# EAGLE board A314-600_v1.0 (EAGLE 7.7.0)
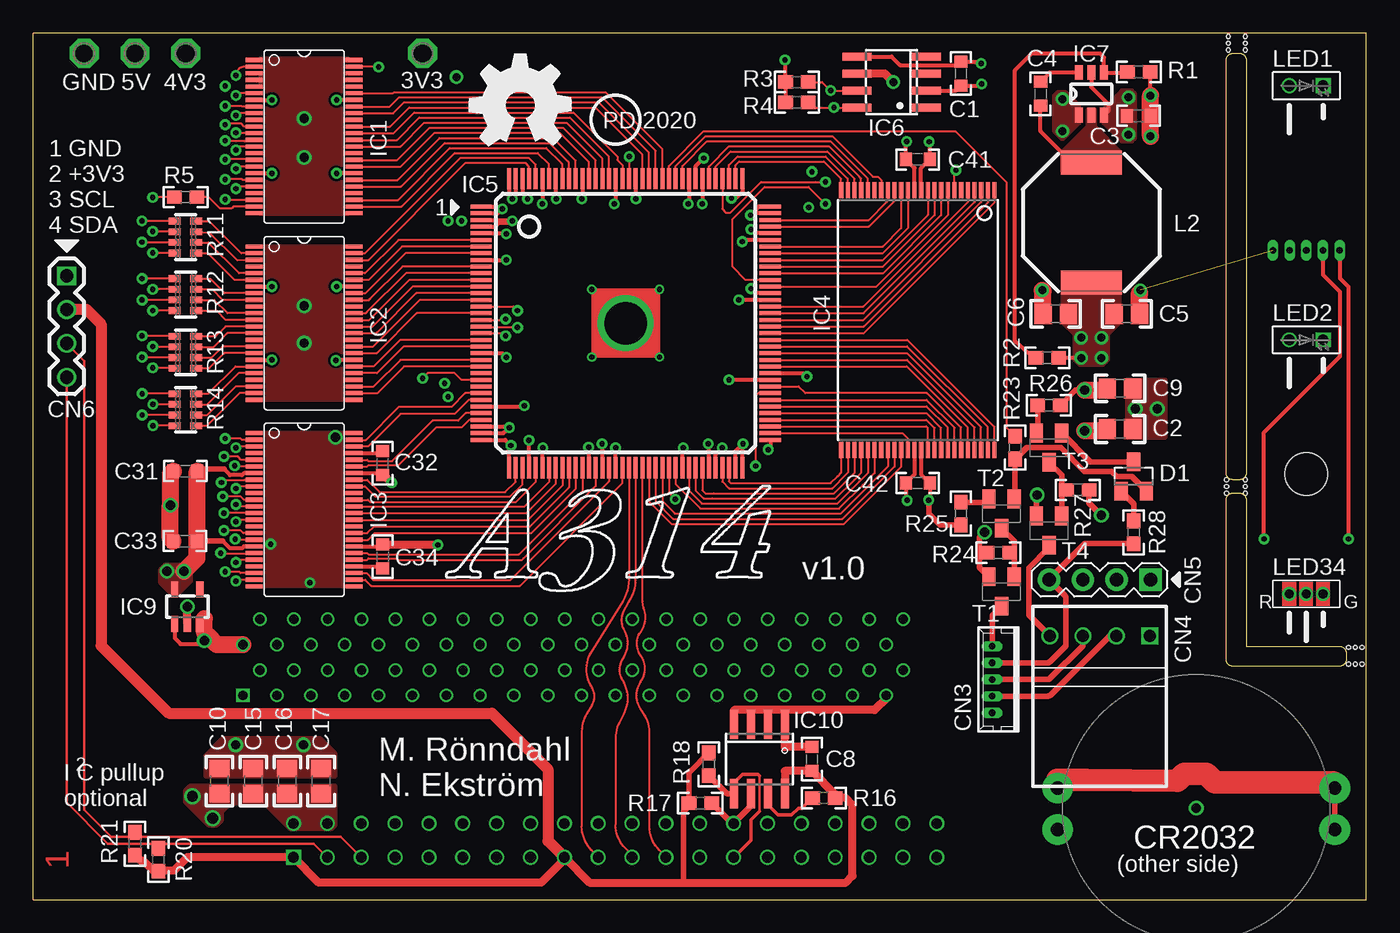
[diagram p5: board, top side]
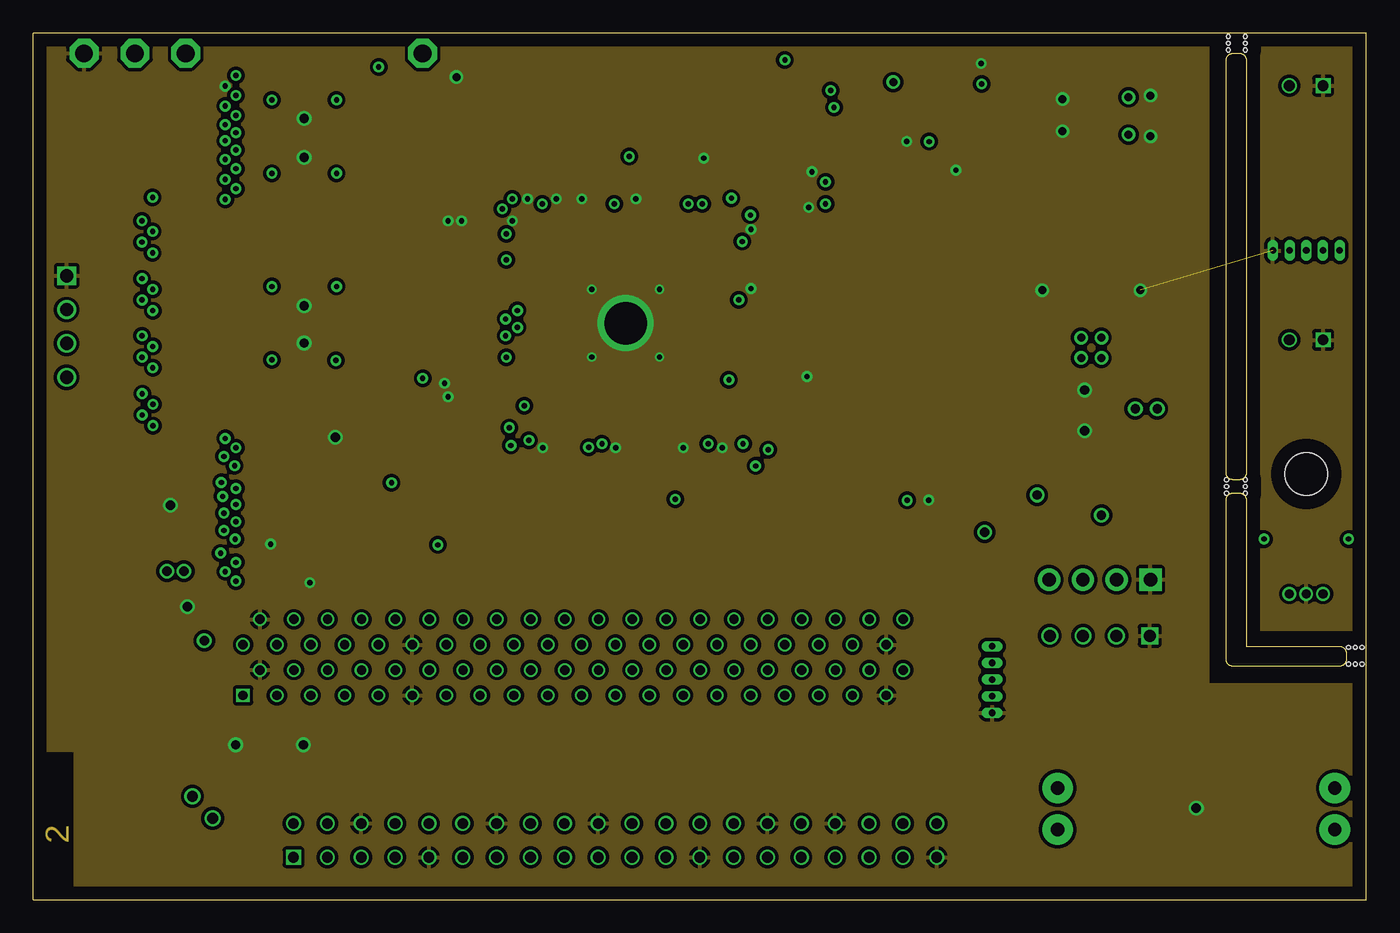
[diagram p6: board, inner layer Ground]
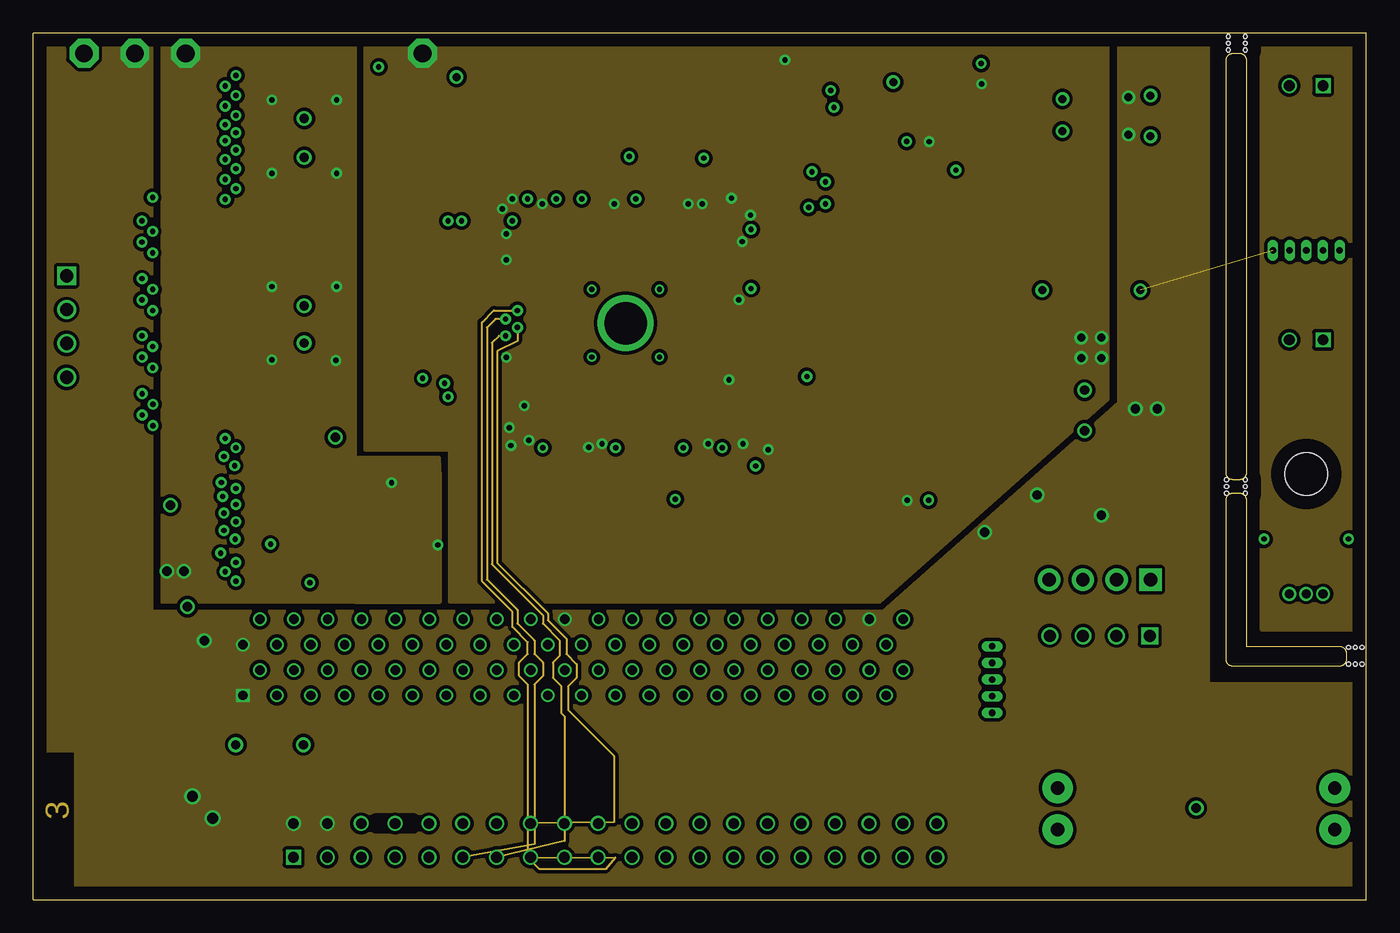
[diagram p7: board, inner layer Power]
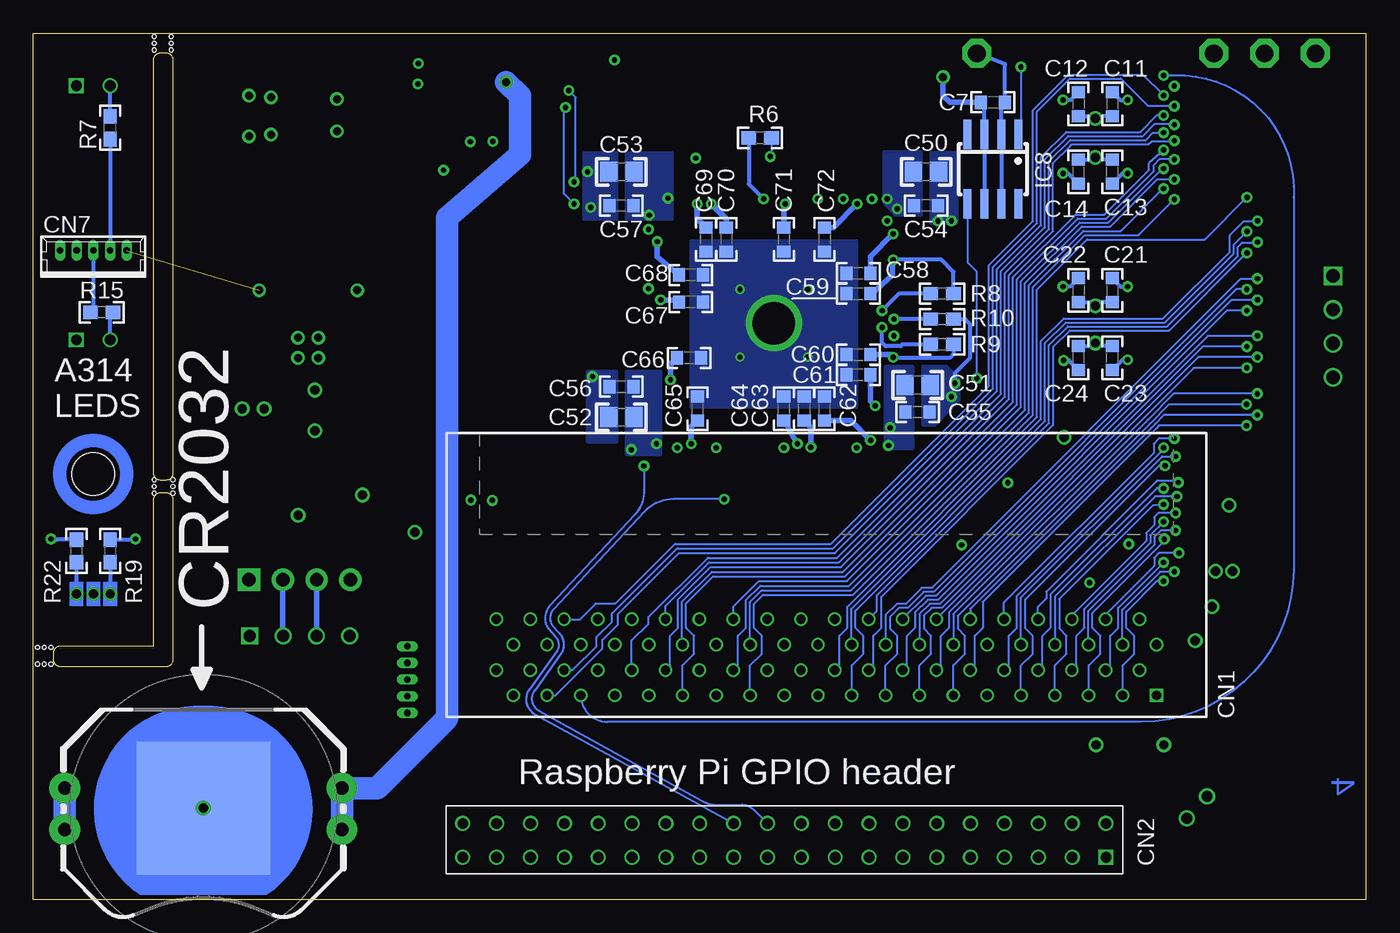
[diagram p8: board, bottom side, seen from below]

Size 100 x 65 mm. Coordinates in mm from the lower left corner, seen from the top.
Outline: 0,0 100,0 100,65 0,65 0,0
Copper layers (1+7*8+16): Top 0.035mm / dielectric 0.185mm / Ground 0.035mm / dielectric 1.15mm / Power 0.035mm / dielectric 0.185mm / Bottom 0.035mm
Design rules "5mil_std *": minimum track width 5mil, minimum drill 0.4mm, track to track 5mil, track to pad 5mil, pad to pad 5mil, via to via 6mil, smd to smd 0mil, copper to edge 40mil, drill to drill 8mil, minimum pad ring 6mil, minimum via ring 8mil, stop-mask expansion 2mil, vias tented up to drill 0.6mm, thermal gap 10mil
Holes 3.2 mm at 95.5,31.94
Holes 0.3 mm at 89.66,63.75 89.66,64.26 89.66,64.77 90.93,63.75 90.93,64.26 90.93,64.77 89.53,30.99 90.93,30.99 89.53,30.48 89.53,31.5 90.93,31.5 90.93,30.48 98.68,18.92 99.19,18.92 99.69,18.92 99.69,17.65 99.19,17.65 98.68,17.65
bKeepout: area 62,38 to 90,65
Milling: 19 lines

## Footprints (pad centres in the part's own frame; a part is rotated, then mirrored left to right if it is on the bottom)
P1-13 = drill 1.321 pad 2.159 octagon: TP 0,0
LINX20XX-THM = drill 1 pad 2.3: +@1 -10.4,1.5; +@2 -10.4,-1.6; +@3 10.4,-1.6; +@4 10.4,1.5 | smd 10 x 10: GND 0,0
C0603 = smd 0.9 x 1: 1 -0.9,0; 2 0.9,0
C0805 = smd 1.3 x 1.5: 1 -0.95,0; 2 0.95,0
CE-2X40_1.27_R = drill 0.7 square: 1 -24.765,-19.685 | drill 0.7: 2 -24.765,-15.875; 3 -23.495,-17.78; 4 -23.495,-13.97; 5 -22.225,-19.685; 6 -22.225,-15.875; 7 -20.955,-17.78; 8 -20.955,-13.97; 9 -19.685,-19.685; 10 -19.685,-15.875; 11 -18.415,-17.78; 12 -18.415,-13.97; 13 -17.145,-19.685; 14 -17.145,-15.875; 15 -15.875,-17.78; 16 -15.875,-13.97; 17 -14.605,-19.685; 18 -14.605,-15.875; 19 -13.335,-17.78; 20 -13.335,-13.97; 21 -12.065,-19.685; 22 -12.065,-15.875; 23 -10.795,-17.78; 24 -10.795,-13.97; 25 -9.525,-19.685; 26 -9.525,-15.875; 27 -8.255,-17.78; 28 -8.255,-13.97; 29 -6.985,-19.685; 30 -6.985,-15.875; 31 -5.715,-17.78; 32 -5.715,-13.97; 33 -4.445,-19.685; 34 -4.445,-15.875; 35 -3.175,-17.78; 36 -3.175,-13.97; 37 -1.905,-19.685; 38 -1.905,-15.875; 39 -0.635,-17.78; 40 -0.635,-13.97; 41 0.635,-19.685; 42 0.635,-15.875; 43 1.905,-17.78; 44 1.905,-13.97; 45 3.175,-19.685; 46 3.175,-15.875; 47 4.445,-17.78; 48 4.445,-13.97; 49 5.715,-19.685; 50 5.715,-15.875; 51 6.985,-17.78; 52 6.985,-13.97; 53 8.255,-19.685; 54 8.255,-15.875; 55 9.525,-17.78; 56 9.525,-13.97; 57 10.795,-19.685; 58 10.795,-15.875; 59 12.065,-17.78; 60 12.065,-13.97; 61 13.335,-19.685; 62 13.335,-15.875; 63 14.605,-17.78; 64 14.605,-13.97; 65 15.875,-19.685; 66 15.875,-15.875; 67 17.145,-17.78; 68 17.145,-13.97; 69 18.415,-19.685; 70 18.415,-15.875; 71 19.685,-17.78; 72 19.685,-13.97; 73 20.955,-19.685; 74 20.955,-15.875; 75 22.225,-17.78; 76 22.225,-13.97; 77 23.495,-19.685; 78 23.495,-15.875; 79 24.765,-17.78; 80 24.765,-13.97
RASPBERRYPIZEROW_NO_HOLES = drill 0.8 square: 1 -24.13,-1.31 | drill 0.8: 2 -24.13,1.23; 3 -21.59,-1.31; 4 -21.59,1.23; 5 -19.05,-1.31; 6 -19.05,1.23; 7 -16.51,-1.31; 8 -16.51,1.23; 9 -13.97,-1.31; 10 -13.97,1.23; 11 -11.43,-1.31; 12 -11.43,1.23; 13 -8.89,-1.31; 14 -8.89,1.23; 15 -6.35,-1.31; 16 -6.35,1.23; 17 -3.81,-1.31; 18 -3.81,1.23; 19 -1.27,-1.31; 20 -1.27,1.23; 21 1.27,-1.31; 22 1.27,1.23; 23 3.81,-1.31; 24 3.81,1.23; 25 6.35,-1.31; 26 6.35,1.23; 27 8.89,-1.31; 28 8.89,1.23; 29 11.43,-1.31; 30 11.43,1.23; 31 13.97,-1.31; 32 13.97,1.23; 33 16.51,-1.31; 34 16.51,1.23; 35 19.05,-1.31; 36 19.05,1.23; 37 21.59,-1.31; 38 21.59,1.23; 39 24.13,-1.31; 40 24.13,1.23
53047-05 = drill 0.5 pad 0.698 long: 1 2.5,0.45; 2 1.25,0.45; 3 0,0.45; 4 -1.25,0.45; 5 -2.5,0.45
FLOPPY_PWR = drill 0.9 square: 1 3.75,4.55 | drill 0.9: 2 1.25,4.55; 3 -1.25,4.55; 4 -3.75,4.55
MA04-1 = drill 1 pad 1.676 square: 1 -3.81,0 | drill 1 pad 1.676: 2 -1.27,0; 3 1.27,0; 4 3.81,0
MA04-1' = drill 1 square: 1 -3.81,0 | drill 1: 2 -1.27,0; 3 1.27,0; 4 3.81,0
SOT23 = smd 1 x 1.4: 1 -0.95,-1.1; 2 0.95,-1.1; 3 0,1.1
PSOP-DGG48 = smd 0.32 x 1.3: 1 -5.75,-3.75; 2 -5.25,-3.75; 3 -4.75,-3.75; 4 -4.25,-3.75; 5 -3.75,-3.75; 6 -3.25,-3.75; 7 -2.75,-3.75; 8 -2.25,-3.75; 9 -1.75,-3.75; 10 -1.25,-3.75; 11 -0.75,-3.75; 12 -0.25,-3.75; 13 0.25,-3.75; 14 0.75,-3.75; 15 1.25,-3.75; 16 1.75,-3.75; 17 2.25,-3.75; 18 2.75,-3.75; 19 3.25,-3.75; 20 3.75,-3.75; 21 4.25,-3.75; 22 4.75,-3.75; 23 5.25,-3.75; 24 5.75,-3.75; 25 5.75,3.75; 26 5.25,3.75; 27 4.75,3.75; 28 4.25,3.75; 29 3.75,3.75; 30 3.25,3.75; 31 2.75,3.75; 32 2.25,3.75; 33 1.75,3.75; 34 1.25,3.75; 35 0.75,3.75; 36 0.25,3.75; 37 -0.25,3.75; 38 -0.75,3.75; 39 -1.25,3.75; 40 -1.75,3.75; 41 -2.25,3.75; 42 -2.75,3.75; 43 -3.25,3.75; 44 -3.75,3.75; 45 -4.25,3.75; 46 -4.75,3.75; 47 -5.25,3.75; 48 -5.75,3.75
TSOP-1_48L_12X20 = smd 1.2 x 0.32: 1 -9.75,5.75; 2 -9.75,5.25; 3 -9.75,4.75; 4 -9.75,4.25; 5 -9.75,3.75; 6 -9.75,3.25; 7 -9.75,2.75; 8 -9.75,2.25; 9 -9.75,1.75; 10 -9.75,1.25; 11 -9.75,0.75; 12 -9.75,0.25; 13 -9.75,-0.25; 14 -9.75,-0.75; 15 -9.75,-1.25; 16 -9.75,-1.75; 17 -9.75,-2.25; 18 -9.75,-2.75; 19 -9.75,-3.25; 20 -9.75,-3.75; 21 -9.75,-4.25; 22 -9.75,-4.75; 23 -9.75,-5.25; 24 -9.75,-5.75; 25 9.75,-5.75; 26 9.75,-5.25; 27 9.75,-4.75; 28 9.75,-4.25; 29 9.75,-3.75; 30 9.75,-3.25; 31 9.75,-2.75; 32 9.75,-2.25; 33 9.75,-1.75; 34 9.75,-1.25; 35 9.75,-0.75; 36 9.75,-0.25; 37 9.75,0.25; 38 9.75,0.75; 39 9.75,1.25; 40 9.75,1.75; 41 9.75,2.25; 42 9.75,2.75; 43 9.75,3.25; 44 9.75,3.75; 45 9.75,4.25; 46 9.75,4.75; 47 9.75,5.25; 48 9.75,5.75
SQFP-S-20X20-144 = smd 0.3 x 1.6: 1 -8.75,-10.85; 2 -8.25,-10.85; 3 -7.75,-10.85; 4 -7.25,-10.85; 5 -6.75,-10.85; 6 -6.25,-10.85; 7 -5.75,-10.85; 8 -5.25,-10.85; 9 -4.75,-10.85; 10 -4.25,-10.85; 11 -3.75,-10.85; 12 -3.25,-10.85; 13 -2.75,-10.85; 14 -2.25,-10.85; 15 -1.75,-10.85; 16 -1.25,-10.85; 17 -0.75,-10.85; 18 -0.25,-10.85; 19 0.25,-10.85; 20 0.75,-10.85; 21 1.25,-10.85; 22 1.75,-10.85; 23 2.25,-10.85; 24 2.75,-10.85; 25 3.25,-10.85; 26 3.75,-10.85; 27 4.25,-10.85; 28 4.75,-10.85; 29 5.25,-10.85; 30 5.75,-10.85; 31 6.25,-10.85; 32 6.75,-10.85; 33 7.25,-10.85; 34 7.75,-10.85; 35 8.25,-10.85; 36 8.75,-10.85; 73 8.75,10.85; 74 8.25,10.85; 75 7.75,10.85; 76 7.25,10.85; 77 6.75,10.85; 78 6.25,10.85; 79 5.75,10.85; 80 5.25,10.85; 81 4.75,10.85; 82 4.25,10.85; 83 3.75,10.85; 84 3.25,10.85; 85 2.75,10.85; 86 2.25,10.85; 87 1.75,10.85; 88 1.25,10.85; 89 0.75,10.85; 90 0.25,10.85; 91 -0.25,10.85; 92 -0.75,10.85; 93 -1.25,10.85; 94 -1.75,10.85; 95 -2.25,10.85; 96 -2.75,10.85; 97 -3.25,10.85; 98 -3.75,10.85; 99 -4.25,10.85; 100 -4.75,10.85; 101 -5.25,10.85; 102 -5.75,10.85; 103 -6.25,10.85; 104 -6.75,10.85; 105 -7.25,10.85; 106 -7.75,10.85; 107 -8.25,10.85; 108 -8.75,10.85 | smd 1.6 x 0.3: 37 10.85,-8.75; 38 10.85,-8.25; 39 10.85,-7.75; 40 10.85,-7.25; 41 10.85,-6.75; 42 10.85,-6.25; 43 10.85,-5.75; 44 10.85,-5.25; 45 10.85,-4.75; 46 10.85,-4.25; 47 10.85,-3.75; 48 10.85,-3.25; 49 10.85,-2.75; 50 10.85,-2.25; 51 10.85,-1.75; 52 10.85,-1.25; 53 10.85,-0.75; 54 10.85,-0.25; 55 10.85,0.25; 56 10.85,0.75; 57 10.85,1.25; 58 10.85,1.75; 59 10.85,2.25; 60 10.85,2.75; 61 10.85,3.25; 62 10.85,3.75; 63 10.85,4.25; 64 10.85,4.75; 65 10.85,5.25; 66 10.85,5.75; 67 10.85,6.25; 68 10.85,6.75; 69 10.85,7.25; 70 10.85,7.75; 71 10.85,8.25; 72 10.85,8.75; 109 -10.85,8.75; 110 -10.85,8.25; 111 -10.85,7.75; 112 -10.85,7.25; 113 -10.85,6.75; 114 -10.85,6.25; 115 -10.85,5.75; 116 -10.85,5.25; 117 -10.85,4.75; 118 -10.85,4.25; 119 -10.85,3.75; 120 -10.85,3.25; 121 -10.85,2.75; 122 -10.85,2.25; 123 -10.85,1.75; 124 -10.85,1.25; 125 -10.85,0.75; 126 -10.85,0.25; 127 -10.85,-0.25; 128 -10.85,-0.75; 129 -10.85,-1.25; 130 -10.85,-1.75; 131 -10.85,-2.25; 132 -10.85,-2.75; 133 -10.85,-3.25; 134 -10.85,-3.75; 135 -10.85,-4.25; 136 -10.85,-4.75; 137 -10.85,-5.25; 138 -10.85,-5.75; 139 -10.85,-6.25; 140 -10.85,-6.75; 141 -10.85,-7.25; 142 -10.85,-7.75; 143 -10.85,-8.25; 144 -10.85,-8.75 | drill 0.4: GB@4 -2.54,-2.54; GP@1 -2.54,2.54; GP@2 2.54,2.54; GP@3 2.54,-2.54 | drill 3.2: GP@5 0,0
SOIC8 = smd 0.6 x 2.2: 1 -1.905,-2.6; 2 -0.635,-2.6; 3 0.635,-2.6; 4 1.905,-2.6; 5 1.905,2.6; 6 0.635,2.6; 7 -0.635,2.6; 8 -1.905,2.6
THIN_SO23 = smd 0.6 x 1.1: 1 -0.95,-1.6; 2 0,-1.6; 3 0.95,-1.6; 4 0.95,1.6; 5 0,1.6; 6 -0.95,1.6
SO08 = smd 0.6 x 2.2: 1 -1.905,-2.6; 2 -0.635,-2.6; 3 0.635,-2.6; 4 1.905,-2.6; 5 1.905,2.6; 6 0.635,2.6; 7 -0.635,2.6; 8 -1.905,2.6
SOT23-DBV = smd 0.55 x 1.2: 1 -0.95,-1.3; 2 0,-1.3; 3 0.95,-1.3; 4 0.95,1.3; 5 -0.95,1.3
SO-08 = smd 0.6 x 2.2: 1 -1.905,-2.6; 2 -0.635,-2.6; 3 0.635,-2.6; 4 1.905,-2.6; 5 1.905,2.6; 6 0.635,2.6; 7 -0.635,2.6; 8 -1.905,2.6
WE-TPC_1028/1038 = smd 4.6 x 1.8: 1 0,4.5; 2 0,-4.5
LED2X5 = drill 0.8: A -1.27,0 | drill 0.8 square: K 1.27,0
DUOLED2X5 = drill 0.7 pad 1.016: AG -1.27,0; AR 1.27,0; K 0,0
R0603 = smd 1.1 x 1: 1 -0.85,0; 2 0.85,0
CTS742C083 = smd 0.5 x 0.9: 1 -1.2,-0.8; 2 -0.4,-0.8; 3 0.4,-0.8; 4 1.2,-0.8; 5 1.2,0.8; 6 0.4,0.8; 7 -0.4,0.8; 8 -1.2,0.8
SOT23-BEC = smd 1 x 1.4: B -0.95,-1.1; C 0,1.1; E 0.95,-1.1

## Placement (x,y rotation side)
3V3  TPPAD1-13  [P1-13]  29.21,63.5 0 top
4V3  TPPAD1-13  [P1-13]  11.43,63.5 0 top
5V  TPPAD1-13  [P1-13]  7.62,63.5 0 top
BAT1  CR2025/CR2032TH  [LINX20XX-THM]  87.25,6.86 0 bottom
C1  100n  [C0603]  69.6,61.98 90 top
C2  22u  [C0805]  81.53,35.31 180 top
C3  100n  [C0603]  82.93,58.8 180 top
C4  100n  [C0603]  75.56,60.45 270 top
C5  22u  [C0805]  82.04,43.94 0 top
C6  22u  [C0805]  76.71,43.94 180 top
C7  100n  [C0603]  28,59.82 180 bottom
C8  100n  [C0603]  58.42,10.54 90 top
C9  22u  [C0805]  81.53,38.35 180 top
C10  22u  [C0805]  13.97,8.89 90 top
C11  100n  [C0603]  19.05,59.69 270 bottom
C12  100n  [C0603]  21.59,59.69 270 bottom
C13  100n  [C0603]  19.05,54.61 90 bottom
C14  100n  [C0603]  21.59,54.61 90 bottom
C15  22u  [C0805]  16.51,8.89 90 top
C16  22u  [C0805]  19.05,8.89 90 top
C17  22u  [C0805]  21.59,8.89 90 top
C21  100n  [C0603]  19.05,45.72 270 bottom
C22  100n  [C0603]  21.59,45.72 270 bottom
C23  100n  [C0603]  19.05,40.64 90 bottom
C24  100n  [C0603]  21.59,40.64 90 bottom
C31  100n  [C0603]  11.4,32.15 180 top
C32  100n  [C0603]  26.21,32.75 90 top
C33  100n  [C0603]  11.38,26.9 180 top
C34  100n  [C0603]  26.21,25.73 270 top
C41  100n  [C0603]  66.36,55.53 180 top
C42  100n  [C0603]  66.36,31.25 0 top
C50  33u  [C0805]  33.02,54.61 0 bottom
C51  33u  [C0805]  33.66,38.61 0 bottom
C52  33u  [C0805]  55.88,36.2 180 bottom
C53  33u  [C0805]  55.88,54.61 180 bottom
C54  100n  [C0603]  33.02,52.07 0 bottom
C55  100n  [C0603]  33.66,36.58 0 bottom
C56  100n  [C0603]  55.88,38.48 180 bottom
C57  100n  [C0603]  55.88,52.07 180 bottom
C58  100n  [C0603]  38.1,46.99 180 bottom
C59  100n  [C0603]  38.1,45.47 180 bottom
C60  100n  [C0603]  38.1,40.89 180 bottom
C61  100n  [C0603]  38.1,39.37 180 bottom
C62  100n  [C0603]  40.64,36.83 90 bottom
C63  100n  [C0603]  42.16,36.83 90 bottom
C64  100n  [C0603]  43.69,36.83 90 bottom
C65  100n  [C0603]  50.16,36.83 90 bottom
C66  100n  [C0603]  50.8,40.64 0 bottom
C67  100n  [C0603]  50.67,44.83 0 bottom
C68  100n  [C0603]  50.67,46.86 0 bottom
C69  100n  [C0603]  49.53,49.53 270 bottom
C70  100n  [C0603]  48.01,49.53 270 bottom
C71  100n  [C0603]  43.69,49.53 270 bottom
C72  100n  [C0603]  40.64,49.53 270 bottom
CN1  A600TDRA_R  [CE-2X40_1.27_R]  40.5,35 0 top
CN2  RASPI_WNH  [RASPBERRYPIZEROW_NO_HOLES]  43.65,4.48 0 top
CN3  53047-05  [53047-05]  72.39,16.51 90 top
CN4  TE171826-4  [FLOPPY_PWR]  80.01,15.24 0 top
CN5  [MA04-1]  80.01,24 180 top
CN6  PIN_HDR  [MA04-1']  2.5,43 270 top
CN7  53047-05  [53047-05]  95.5,48.26 0 bottom
D1  RB715UMTL  [SOT23]  82.55,31.75 0 top
GND  TPPAD1-13  [P1-13]  3.81,63.5 0 top
IC1  SN74CBT16244CDGG  [PSOP-DGG48]  20.32,57.25 270 top
IC2  SN74CBT16244CDGG  [PSOP-DGG48]  20.32,43.25 270 top
IC3  SN74CBT16244CDGG  [PSOP-DGG48]  20.32,29.25 270 top
IC4  IS61WV102416FBLL-TLI  [TSOP-1_48L_12X20]  66.36,43.5 270 top
IC5  10M08SCE144  [SQFP-S-20X20-144]  44.44,43.25 270 top
IC6  DS3231M  [SOIC8]  64.39,61.34 90 top
IC7  TPS565208  [THIN_SO23]  79.38,60.45 0 top
IC8  NB3N502  [SO08]  28,54.8 180 bottom
IC9  TPS77033  [SOT23-DBV]  11.56,21.97 0 top
IC10  24AA32ASN  [SO-08]  54.48,10.54 180 top
L2  2.2uH  [WE-TPC_1028/1038]  79.38,50.8 0 top
LED1  SSL-LX2573GD  [LED2X5]  95.5,61.07 0 top
LED2  SSL-LX2573YD  [LED2X5]  95.5,42 0 top
LED34  SSL-LX2577IGW  [DUOLED2X5]  95.5,22.93 0 top
R1  10k2  [R0603]  82.93,62.1 180 top
R2  34k  [R0603]  76.07,40.64 0 top
R3  3k9  [R0603]  57.28,61.34 180 top
R4  3k9  [R0603]  57.28,59.82 180 top
R5  47  [R0603]  11.43,52.7 0 top
R6  10k  [R0603]  45.47,57.15 180 bottom
R7  150  [R0603]  94.23,57.91 90 bottom
R8  10k  [R0603]  31.81,45.47 0 bottom
R9  10k  [R0603]  31.81,41.66 0 bottom
R10  1k  [R0603]  31.81,43.56 180 bottom
R11  47  [CTS742C083]  11.42,49.71 270 top
R12  47  [CTS742C083]  11.42,45.39 270 top
R13  47  [CTS742C083]  11.42,41.07 270 top
R14  47  [CTS742C083]  11.42,36.75 270 top
R15  150  [R0603]  94.87,44.07 0 bottom
R16  1k  [R0603]  59.31,7.62 0 top
R17  3k9  [R0603]  50.04,7.24 0 top
R18  3k9  [R0603]  50.67,10.16 90 top
R19  150  [R0603]  94.23,26.16 270 bottom
R20  3k9  [R0603]  9.4,3 90 top
R21  3k9  [R0603]  7.62,4.19 90 top
R22  150  [R0603]  96.77,26.16 270 bottom
R23  4k7  [R0603]  73.66,33.91 270 top
R24  10k  [R0603]  72.39,26.04 180 top
R25  470  [R0603]  69.6,28.96 90 top
R26  470  [R0603]  76.2,37.08 180 top
R27  10k  [R0603]  78.36,30.73 0 top
R28  4k7  [R0603]  82.55,27.56 270 top
T1  2N4403  [SOT23-BEC]  72.64,23.11 180 top
T2  2N4401  [SOT23-BEC]  72.64,28.96 180 top
T3  2N4401  [SOT23-BEC]  76.2,33.91 180 top
T4  2N4403  [SOT23-BEC]  76.2,27.69 180 top
U$1  [OSHW_8_NOTEXT]  36.51,59.59 0 top
U$2  [A314_LOGO]  30.86,23.11 0 top

## Tracks (layer width: path | path; a pad name or v marks a point on that pad's centre or on a via)
3VA0
  Top 0.15: IC5.25 27.81,40 25.91,38.1 25.81,38 IC2.26
3VA1
  Top 0.15: IC5.24 27.55,40.5 25.65,38.61 25.55,38.5 IC2.27
3VA2
  Top 0.15: IC5.22 27.78,41.5 25.78,39.5 IC2.29
3VA3
  Top 0.15: IC5.21 27.52,42 25.53,40.01 IC2.30
3VA4
  Top 0.15: IC5.17 28.76,44 25.78,41.02 25.76,41 IC2.32
3VA5
  Top 0.15: IC5.15 29,45 25.53,41.53 25.5,41.5 IC2.33
3VA6
  Top 0.15: IC5.14 28.74,45.5 25.78,42.55 25.74,42.5 IC2.35
3VA7
  Top 0.15: IC5.13 28.47,46 25.53,43.05 25.47,43 IC2.36
3VA8
  Top 0.15: IC5.12 28.21,46.5 25.27,43.56 25.21,43.5 IC2.37
3VA9
  Top 0.15: IC5.11 27.95,47 25.02,44.07 24.95,44 IC2.38
3VCASL0
  Top 0.15: IC5.8 27.93,48.5 25.02,45.59 24.93,45.5 IC2.41
3VCASL1
  Top 0.15: IC5.7 27.66,49 25.15,46.48 24.09,46.48 IC2.43
3VCASU0
  Top 0.15: IC5.10 27.69,47.5 25.27,45.09 25.19,45 IC2.40
3VCASU1
  Top 0.15: IC5.6 27.4,49.5 24.89,46.99 IC2.44
3VCCK  (via drill 0.4)
  Top 0.15: v25.91,62.48 24.09,62.48 IC1.47
  Bottom 0.15: v25.91,62.48 25.91,57.59 IC8.1
3VCPA2
  Top 0.15: IC1.33 27.31,55.5 29.72,57.91 39.75,57.91 42.04,55.63 42.19,55.47 IC5.131
3VCPA3
  Top 0.15: IC1.35 27.54,56.5 29.34,58.29 40.01,58.29 42.55,55.75 42.69,55.61 IC5.130
3VCPA4
  Top 0.15: IC1.36 27.28,57 28.96,58.67 40.26,58.67 43.05,55.88 43.19,55.74 IC5.129
3VCPA5
  Top 0.15: IC1.37 27.02,57.5 28.57,59.05 40.51,59.05 43.81,55.75 43.81,55.5 44.2,55.12 IC5.127
3VCPD0
  Top 0.15: IC1.27 27.35,52.5 31.24,56.39 38.48,56.39 39.62,55.24 39.69,55.18 IC5.136
3VCPD1
  Top 0.15: IC1.29 27.59,53.5 30.86,56.77 38.73,56.77 40.13,55.37 40.19,55.31 IC5.135
3VCPD2
  Top 0.15: IC1.30 27.33,54 30.48,57.15 38.99,57.15 40.64,55.5 40.69,55.45 IC5.134
3VCPD3
  Top 0.15: IC1.32 27.57,55 29.97,57.4 30.1,57.53 39.5,57.53 41.66,55.37 41.69,55.34 IC5.132
3VD0
  Top 0.15: IC5.54 44.2,31.24 36.5,23.55 25.35,23.55 24.9,24 IC3.26
3VD1
  Top 0.15: IC5.52 43.19,31.38 35.81,24 25.5,24 25,24.5 IC3.27
3VD2
  Top 0.15: IC5.50 42.19,31.01 36.78,25.6 36.68,25.5 27.35,25.5 27.25,25.6 25.15,25.6 25.05,25.5 IC3.29
3VD3
  Top 0.15: IC5.48 41.19,30.65 36.44,25.9 25.15,25.9 25.05,26 IC3.30
3VD4
  Top 0.15: IC3.32 25.1,27 25.6,27.5 37.37,27.5 40.69,30.82 IC5.47
3VD5
  Top 0.15: IC5.46 40.19,30.92 37.27,28 25.55,28 25.05,27.5 IC3.33
3VD6
  Top 0.15: IC3.35 37.14,28.5 39.69,31.05 IC5.45
3VD7
  Top 0.15: IC3.36 37,29 39.19,31.19 IC5.44
3VD8
  Top 0.15: IC3.37 36.87,29.5 38.69,31.32 IC5.43
3VD9
  Top 0.15: IC3.38 25.12,30 25.27,29.84 36.22,29.84 37.69,31.34 IC5.41
3VD10
  Top 0.15: IC3.40 24.88,31 25.65,30.23 35.77,30.23 36.69,31.15 IC5.39
3VD11
  Top 0.15: IC3.41 25.05,31.5 25.98,30.57 35.41,30.57 36.19,31.35 IC5.38
3VD12
  Top 0.15: IC5.33 32.7,36 32.13,35.43 30.23,35.43 27.39,32.6 25.15,32.6 25.05,32.5 IC3.43 24.08,32.51
3VD13
  Top 0.15: IC5.32 32.44,36.5 31.88,35.94 29.97,35.94 26.93,32.9 25.15,32.9 25.05,33 IC3.44
3VD14
  Top 0.15: IC5.30 32.67,37.5 31.62,36.45 27.55,36.45 25.1,34 24.4,34 IC3.46
3VD15
  Top 0.15: IC5.29 32.41,38 31.37,36.96 27.41,36.96 24.95,34.5 IC3.47
3VINT2
  Top 0.15: IC1.38 26.76,58 28.19,59.44 42.16,59.44 45.69,55.91 IC5.124
3VIORD
  Top 0.15: IC1.41 26.73,59.5 27.43,60.2 42.67,60.2 46.69,56.18 IC5.122
3VIOWR
  Top 0.15: IC1.43 26.97,60.5 27.05,60.58 42.93,60.58 47.19,56.31 IC5.121
3VRAS0
  Top 0.15: IC2.46 25.14,48 32.13,54.99 32.38,55.24 36.96,55.24 37.19,55.01 IC5.141
3VRAS1
  Top 0.15: IC2.47 24.88,48.5 32,55.63 37.21,55.63 37.69,55.15 IC5.140
3VRTCCS
  Top 0.15: IC1.40 27,59 27.81,59.82 42.42,59.82 46.19,56.05 IC5.123
3VWE
  Top 0.15: IC1.26 27.62,52 31.62,56.01 37.85,56.01 38.69,55.16 IC5.138
5V_PI
  cutout Power: 25.02,5.71 arc-90 25.78,6.48 28.45,6.48 arc-90 29.21,5.71 arc-90 28.45,4.95 25.78,4.95 arc-90
14MHZ  (via drill 0.4)
  Top 0.15: IC5.27 32.12,39 31.75,39.37 31.62,39.5 29.59,39.5 v29.21,39.12
  Bottom 0.15: v29.21,39.12 29.21,47.12 29.84,47.75 29.91,47.82 IC8.5
+  (via drill 0.6)
  Top 0.406: BAT1.+@2 97.65,7.76
  Top 0.61: v64.52,61.34 63.88,61.98 IC6.6
  Top 1.676: BAT1.+@4 76.85,9 79,9 85.83,8.9 86.36,9.43 88.01,9.43 88.65,8.79 97.55,8.79 BAT1.+@1
  Bottom 1.676: BAT1.+@1 BAT1.+@2 | BAT1.+@3 BAT1.+@4 74.19,8.36 68.96,13.59 68.96,51.18 63.5,55.88 63.5,60.33 v64.52,61.34
+3V3  (via drill 0.4, 0.6)
  Top 0.305: IC4.12 66.61,54.88 C41.1 67.26,56.82 v67.21,56.88 | IC4.36 66.11,31.9 C42.1 65.46,30.05 v65.56,29.95 | IC5.9 v35.49,48 | IC5.5 35.44,50 v35.49,49.95 | IC5.23 35.19,41 v35.49,40.7 | IC5.31 36.79,37 v36.84,37.05 | IC5.34 35.63,35.5 v35.72,35.41 35.24,35 IC5.35 | IC5.36 35.41,34.5 v35.84,34.07 35.69,33.8 IC5.37 | IC5.143 36.19,52.83 v35.94,52.58 35.69,52.83 IC5.144 | IC5.1 34.99,52 v35.18,51.82 34.86,51.5 IC5.2 | IC5.40 v37.19,34.45 | IC5.49 41.69,33.92 v41.66,33.95 | IC5.51 42.69,34.17 v42.66,34.2 | IC5.67 50.69,34.15 v50.64,34.2 | IC5.71 52.69,33.64 v53.25,34.2 53.19,34.14 IC5.72 | IC5.73 55.29,33.91 v55.14,33.76 | IC5.82 v52.19,39 | IC5.128 43.69,52.3 v43.59,52.2 | IC5.139 v38.19,52.2 | v56.39,62.99 56.39,61.38 R3.2 R4.2 | v71.14,61.19 71.03,61.08 C1.1 69.23,60.71 IC6.2 | IC5.115 v50.19,52.2 | IC5.117 49.19,52.25 v49.14,52.2 | IC5.103 53.32,49.5 v53.19,49.37 | IC5.94 v52.94,45 | v78.61,40.64 R2.2 | IC5.109 53.19,53.1 52.69,52.6 52.41,52.6 v52.38,52.63 | IC5.107 53.94,51.5 v53.8,51.36 54.44,52 IC5.108
  Bottom 0.305: C59.1 37.08,45.47 | 35.56,47.93 v35.49,48 v35.48,48.01 31.88,48.01 30.96,47.09 R8.2 | C70.1 48.01,50.55 | R9.2 30.96,40.92 31.24,40.64 35.43,40.64 v35.49,40.7 | IC8.7 IC8.2 27.37,59.55 C7.1 27.1,62.66 3V3.TP
  Bottom 0.406: C60.1 35.56,40.89 v35.49,40.7 | C61.1 37.2,37.41 v36.84,37.05 | 37.08,45.47 35.56,46.86 35.56,47.93 | C58.1 37.2,48.24 v35.49,49.95 | C72.1 39.96,50.43 v38.19,52.2 | v50.19,52.2 50.19,51.09 C69.1 | 48.01,50.55 48.01,51.05 49.15,52.2 v49.14,52.2 | C68.1 53.19,48.23 v53.19,49.37 | C66.1 52.19,40.15 v52.19,39 | C64.1 43.35,35.34 v42.66,34.2 | C65.1 50.64,35.45 v50.64,34.2 | v43.59,52.2 43.69,52.1 C71.1 | C67.1 51.74,45 v52.94,45 | C62.1 38.66,35.93 v37.19,34.45 | C63.1 41.66,35.43 v41.66,33.95
  other vias: 80.14,42.16 78.61,42.16 80.14,40.64
  pour Bottom (no thermals): 55.5,33.41 52.96,33.41 52.96,39.6 55.5,39.6
  pour Bottom (no thermals): 36.07,33.8 34.03,33.83 34.04,40.01 36.07,40.01
  pour Bottom (no thermals): 36.2,56.1 36.2,52.32 35.31,51.37 33.4,51.37 33.4,56.1
  pour Bottom (no thermals): 55.5,51.05 52.07,51.05 52.07,56.01 55.5,56.01
  pour Power (isolate 0.254, no thermals): 24.89,64.77 24.89,33.78 31.24,33.78 31.24,22.35 63.5,22.35 80.61,37.56 80.61,64.77
  pour Top (no thermals): 77.22,46.99 77.22,43.31 78.11,42.42 78.11,40.51 78.49,40.13 80.26,40.13 80.64,40.51 80.64,42.42 81.53,43.31 81.53,46.99
+4.3V  (via drill 0.4, 0.7)
  Top 0.305: IC1.7 v17.9,60 | IC1.42 v22.75,60 | IC1.31 v22.75,54.5 | IC1.18 v17.9,54.5 | IC2.18 v17.9,40.5 | IC2.7 v17.9,46 | IC2.42 v22.75,46 | IC2.31 22.75,40.5 v22.7,40.45 | IC3.18 15.8,26.5 15.65,26.35 14.75,26.35 14.2,26.9 | IC3.7 15.8,32 15.65,31.85 14.75,31.85 14.3,32.3 | 12.5,32.3 12.3,32.1 12.3,31.75 | IC3.42 26.06,32 C32.1 | IC3.31 26.08,26.5 C34.1
  Top 0.406: 14.2,26.9 C33.1 | 14.3,32.3 12.5,32.3
  Top 0.61: v26.88,31.27 26.27,31.91 C32.1 | v30.35,26.61 26.23,26.61 C34.1
  Top 1.27: v11.3,24.64 12.28,25.61 C33.1 12.3,26.92 12.3,31.75 C31.1
  Bottom 0.305: C23.1 18.29,40.5 v17.9,40.5 | C24.1 22.3,40.45 v22.7,40.45 | C21.1 18.43,46 v17.9,46 | C22.1 22.21,46 v22.75,46 | C13.1 18.26,54.5 v17.9,54.5 | C14.1 22.38,54.5 v22.75,54.5 | C11.1 18.46,60 v17.9,60 | C12.1 22.18,60 v22.75,60
  other vias: 10.03,24.64
  pour Power (isolate 0.254, no thermals): 9.65,64.77 9.65,22.35 24.13,22.35 24.13,22.35 30.5,22.35 30.5,31.8 30.45,33.12 24.13,33.12 24.13,64.77
  pour Top (no thermals): 10.41,22.86 9.53,23.75 9.53,24.77 9.91,25.15 11.43,25.15 11.81,24.77 11.81,23.88 10.79,22.86
+5V  (via drill 0.6, 0.7, 0.8)
  Top 0.305: IC7.5 79.38,60.96 80.64,59.69 80.64,59.17 IC7.3 | 12.83,21.08 12.83,20.99 IC9.3 | IC9.1 10.61,19.62 11.05,19.18 12.45,19.18 13.08,19.81
  Top 0.406: T1.E 70.99,24.91 70.99,26.04 | 70.99,26.04 70.99,27.18 v71.37,27.56 | R27.2 79.21,29.76 v80.14,28.83 | T4.E 75.25,30.29 v75.31,30.35 | R24.2 70.99,26.04
  Top 1.27: CN1.2 13.77,19.12 13.08,19.81 12.83,20.07 12.83,21.08
  other vias: 84.33,36.83 82.68,36.83 82.17,60.2 82.17,57.4 12.83,19.43 11.94,7.75 13.46,6.1
  pour Power (isolate 0.254, rank 2, no thermals): 3.17,0 99.11,0 99.11,16.13 88.14,16.13 88.14,64.77 81.44,64.77 81.44,37.24 63.75,21.59 8.89,21.59 8.89,64.77 0.17,64.77 0,11.19 3.17,11.19
  pour Top (no thermals): 82.04,34.67 84.96,34.67 84.96,38.99 82.04,38.99
  pour Top (no thermals): 80.26,58.29 81.66,56.9 82.42,56.9 82.68,57.15 82.68,60.45 82.42,60.71 81.66,60.71 80.26,59.31
  pour Top (no thermals): 12.06,8.5 22.61,8.5 22.61,5.59 22.35,5.33 19.3,5.33 17.4,7.24 14.73,7.24 14.1,6.6 14.1,5.97 13.72,5.59 13.21,5.59 11.43,7.37 11.43,8.13 11.81,8.51
A2  (via drill 0.4)
  Top 0.15: IC1.16 16.53,55.54 v14.4,55.54
  Bottom 0.15: CN1.57 51.3,17.57 50.42,18.45 50.42,19.8 51.02,20.4 51.02,22.22 48.99,24.25 39.09,24.25 26.2,37.14 26.2,46.5 26.2,46.55 21.65,51.1 19.5,51.1 15.95,54.65 15.95,55.1 15.51,55.54 v14.4,55.54
A3  (via drill 0.4)
  Top 0.15: IC1.14 15.46,56.5 v15.2,56.24
  Bottom 0.15: CN1.58 51.3,19.18 51.32,19.2 51.32,22.37 49.09,24.6 39.29,24.6 39.24,24.6 26.5,37.34 26.5,46.65 26.5,46.7 21.8,51.4 19.65,51.4 16.3,54.75 16.3,55.25 16.29,55.25 v15.2,56.24
A4  (via drill 0.4)
  Top 0.15: IC1.13 15.84,56.9 14.61,56.9 14.44,56.9 v14.4,56.94
  Bottom 0.15: CN1.59 52.56,17.2 52.22,17.55 52.22,19.8 51.62,20.4 51.62,22.52 49.61,24.53 49.19,24.95 39.39,24.95 26.8,37.54 26.8,46.85 23.5,50.16 23.5,55.24 22.25,56.49 22.07,56.66 16.36,56.66 16.34,56.66 16.1,56.9 14.44,56.9 v14.4,56.94
A5  (via drill 0.4)
  Top 0.15: IC1.12 15.24,57.5 v15.2,57.54
  Bottom 0.15: CN1.60 52.56,22.04 49.3,25.3 39.54,25.3 27.1,37.74 27.1,47 23.8,50.3 23.8,55.4 22.2,57 16.55,57 16.01,57.54 v15.2,57.54
A314  (via drill 0.4)
  Top 0.305: v98.68,27.05 98.68,45.97 98.04,46.61 98.04,48.67 CN7.5
  Bottom 0.305: R22.1 98.21,27.01 v98.68,27.05
A_314
  Top 0.406: T4.C 76.2,26.42 74.68,24.89 74.68,21.37 CN4.4
A_A314
  Top 0.406: CN3.1 71.94,21.2 arc-45 72.01,21.38 T1.C
A_FD
  Top 0.406: CN3.3 76.09,16.51 arc45 76.27,16.58 78.74,19.05 78.74,19.74 arc-45 CN4.3
  Bottom 0.406: CN5.3 78.74,19.81 CN4.3
A_HD
  Top 0.406: R28.2 78.91,26.71 CN5.4 77.4,22.81 arc-45 77.47,22.63 77.47,19.05 76.25,17.83 arc-45 76.08,17.76 CN3.2
A_PW
  Top 0.406: CN3.4 76.11,15.26 arc45 76.29,15.33 80.68,19.72 arc-45 80.86,19.79 CN4.2
  Bottom 0.406: CN5.2 81.28,19.81 CN4.2
BCASL0  (via drill 0.4)
  Top 0.15: R12.1 v8.16,46.59
  Bottom 0.15: v8.16,46.59 9.41,46.59 32.6,23.4 33.35,23.4 34.55,22.2 35.2,22.2 36.05,21.34 CN1.34
BCASL1  (via drill 0.4)
  Top 0.15: R11.4 8.97,48.51 v8.95,48.53
  Bottom 0.15: CN1.35 37.33,17.2 36.98,17.55 36.98,19.8 36.38,20.4 36.38,22.71 23.5,35.59 23.5,41.45 22.25,42.7 14.78,42.7 v8.95,48.53
BCASU0  (via drill 0.4)
  Top 0.15: R12.2 v8.96,45.79
  Bottom 0.15: CN1.33 36.05,17.57 35.18,18.45 35.18,19.8 35.73,20.35 35.73,21.22 35.05,21.9 34.4,21.9 33.2,23.1 32.45,23.1 9.76,45.79 v8.96,45.79
BCASU1  (via drill 0.4)
  Top 0.15: R11.3 8.17,49.31 v8.15,49.33
  Bottom 0.15: v8.15,49.33 8.18,49.3 9.3,49.3 9.65,48.95 9.65,48.3 14.95,43 22.4,43 23.8,41.6 23.8,35.74 36.71,22.83 36.71,21.64 CN1.36
BRAS0  (via drill 0.4)
  Top 0.15: R11.2 8.97,50.11 v8.95,50.13
  Bottom 0.15: CN1.37 38.59,17.57 37.72,18.45 37.72,19.8 38.32,20.4 38.32,21.67 24.1,35.89 24.1,41.75 22.55,43.3 15.1,43.3 9.95,48.45 9.95,49.13 v8.95,50.13
BRAS1  (via drill 0.4)
  Top 0.15: R11.1 8.17,50.91 v8.15,50.93
  Bottom 0.15: CN1.38 38.59,19.18 38.62,19.2 38.62,21.82 24.4,36.04 24.4,41.9 22.7,43.6 15.25,43.6 10.25,48.6 10.25,49.85 9.2,50.9 8.18,50.9 v8.15,50.93
BST1
  Top 0.305: IC7.6 76.27,62.05 C4.1
BWE  (via drill 0.4)
  Top 0.15: R5.1 8.96,52.7 v8.95,52.69
  Bottom 0.15: CN1.39 39.87,17.2 39.52,17.55 39.52,19.8 38.92,20.4 38.92,21.97 24.7,36.19 24.7,45.78 20.95,49.53 12.11,49.53 v8.95,52.69
CCK  (via drill 0.4)
  Top 0.15: IC1.2 15.86,62.5 arc90 v15.2,61.84
  Bottom 0.15: v15.2,61.84 13.58,61.84 arc90 5.45,52.7 5.45,24.77 arc90 16.88,13.34 56.94,13.34 arc90 CN1.69
CONF_SEL  (via drill 0.4)
  Top 0.15: v44.7,55.75 44.7,54.11 IC5.126
  Bottom 0.15: R6.1 44.62,55.84 v44.7,55.75
D0  (via drill 0.4)
  Top 0.15: IC1.22 14.44,52.5 v14.4,52.54
  Bottom 0.15: CN1.49 46.22,17.57 45.34,18.45 45.34,19.8 45.94,20.4 45.94,22.17 45.25,22.86 38.5,22.86 25,36.37 25,45.95 21.1,49.85 17.09,49.85 v14.4,52.54
D1  (via drill 0.4)
  Top 0.15: IC1.20 15.36,53.5 v15.2,53.34
  Bottom 0.15: CN1.50 46.22,19.18 46.24,19.2 46.24,22.32 45.36,23.2 38.64,23.2 25.3,36.54 25.3,46.1 21.23,50.16 18.41,50.16 15.24,53.34 v15.2,53.34
D2  (via drill 0.4)
  Top 0.15: IC1.19 15.7,54 15.66,54.04 v14.4,54.04
  Bottom 0.15: CN1.51 47.48,17.2 47.14,17.55 47.14,19.8 46.54,20.4 46.54,22.47 45.46,23.55 38.79,23.55 25.6,36.74 25.6,46.25 21.35,50.5 19.2,50.5 15.66,54.04 v14.4,54.04
D3  (via drill 0.4)
  Top 0.15: IC1.17 15.36,55 v15.2,54.84
  Bottom 0.15: CN1.52 47.48,21.98 45.57,23.9 38.94,23.9 25.9,36.94 25.9,46.4 21.5,50.8 19.35,50.8 15.31,54.84 v15.2,54.84
DRA0  (via drill 0.4)
  Top 0.15: R14.4 v8.98,35.55 v8.97,35.56
  Bottom 0.15: CN1.23 29.7,17.2 29.36,17.55 29.36,19.8 28.76,20.4 28.76,22.34 16,35.1 15.74,35.36 15.54,35.56 v8.97,35.56
DRA1  (via drill 0.4)
  Top 0.15: R14.3 v8.18,36.35 v8.17,36.36
  Bottom 0.15: CN1.24 29.7,21.59 29.7,21.82 16.13,35.4 15.83,35.7 15.17,36.36 v8.17,36.36
DRA2  (via drill 0.4)
  Top 0.15: R14.2 v8.98,37.15 v8.97,37.16
  Bottom 0.15: CN1.25 30.98,17.57 30.1,18.45 30.1,19.8 30.65,20.35 30.65,21.3 16.25,35.7 14.79,37.16 v8.97,37.16
DRA3  (via drill 0.4)
  Top 0.15: R14.1 v8.18,37.95 v8.17,37.96
  Bottom 0.15: v8.17,37.96 14.44,37.96 16.4,36 30.98,21.43 CN1.26
DRA4  (via drill 0.4)
  Top 0.15: R13.4 8.99,39.87 v8.96,39.9
  Bottom 0.15: CN1.27 32.24,17.2 31.9,17.55 31.9,19.8 31.3,20.4 31.3,21.55 12.95,39.9 v8.96,39.9
DRA5  (via drill 0.4)
  Top 0.15: R13.3 8.19,40.67 v8.16,40.7
  Bottom 0.15: v8.16,40.7 12.6,40.7 32.24,21.05 CN1.28
DRA6  (via drill 0.4)
  Top 0.15: R13.2 8.99,41.47 v8.96,41.5
  Bottom 0.15: CN1.29 33.52,17.57 32.64,18.45 32.64,19.8 33.19,20.35 33.19,21.31 32.6,21.9 31.85,21.9 12.25,41.5 v8.96,41.5
DRA7  (via drill 0.4)
  Top 0.15: R13.1 8.19,42.27 v8.16,42.3
  Bottom 0.15: v8.16,42.3 11.9,42.3 32,22.2 32.75,22.2 33.52,21.43 CN1.30
DRA8  (via drill 0.4)
  Top 0.15: R12.4 v8.96,44.19
  Bottom 0.15: CN1.31 34.78,17.2 34.44,17.55 34.44,19.8 33.84,20.4 33.84,21.56 32.9,22.5 32.15,22.5 10.46,44.19 v8.96,44.19
DRA9  (via drill 0.4)
  Top 0.15: R12.3 v8.16,44.99
  Bottom 0.15: v8.16,44.99 10.11,44.99 32.3,22.8 33.05,22.8 34.78,21.07 CN1.32
DRD0  (via drill 0.4)
  Top 0.15: IC3.23 15.3,24 v15.2,23.9
  Bottom 0.15: CN1.5 18.27,17.57 17.4,18.45 17.4,19.8 18,20.4 18,21.6 15.7,23.9 v15.2,23.9
DRD1  (via drill 0.4)
  Top 0.15: IC3.22 15.55,24.5 15.45,24.6 v14.4,24.6
  Bottom 0.15: CN1.6 18.27,19.18 18.3,19.2 18.3,21.75 15.45,24.6 v14.4,24.6
DRD2  (via drill 0.4)
  Top 0.15: IC3.20 15.3,25.5 v15.2,25.3
  Bottom 0.15: CN1.7 19.55,17.2 19.2,17.55 19.2,19.8 18.6,20.4 18.6,21.9 v15.2,25.3
DRD3  (via drill 0.4)
  Top 0.15: IC3.19 16.52,25.95 14.1,25.95 v14.05,26
  Bottom 0.15: CN1.8 19.55,21.41 15.9,25.05 15.9,25.65 15.55,26 v14.05,26
DRD4  (via drill 0.4)
  Top 0.15: IC3.17 15.3,27 v15.15,27.05
  Bottom 0.15: CN1.9 20.82,17.57 19.94,18.45 19.94,19.8 20.54,20.4 20.54,21.5 15.14,26.9 v15.15,27.05
DRD5  (via drill 0.4)
  Top 0.15: IC3.16 15.75,27.5 15.55,27.7 v14.3,27.7
  Bottom 0.15: CN1.10 20.82,19.18 20.84,19.2 20.84,21.65 15.9,26.59 15.9,27.2 15.4,27.7 v14.3,27.7
DRD6  (via drill 0.4)
  Top 0.15: IC3.14 15.35,28.5 v15.2,28.35
  Bottom 0.15: CN1.11 22.09,17.2 21.74,17.55 21.74,19.8 21.14,20.4 21.14,21.8 16.2,26.74 16.2,27.35 v15.2,28.35
DRD7  (via drill 0.4)
  Top 0.15: IC3.13 v14.3,29
  Bottom 0.15: CN1.12 22.09,21.32 16.5,26.9 16.5,27.5 15.9,28.1 15.9,28.7 15.6,29 v14.3,29
DRD8  (via drill 0.4)
  Top 0.15: IC3.12 15.3,29.5 v15.2,29.65
  Bottom 0.15: CN1.13 23.36,17.57 22.48,18.45 22.48,19.8 23.03,20.35 23.03,22.55 15.98,29.6 v15.2,29.65
DRD9  (via drill 0.4)
  Top 0.15: IC3.11 15.8,30 15.55,30.25 v14.2,30.25
  Bottom 0.15: 23.36,19.18 CN1.14 23.36,22.73 15.83,30.25 v14.2,30.25
DRD10  (via drill 0.4)
  Top 0.15: IC3.9 15.3,31 v15.2,30.85
  Bottom 0.15: CN1.15 24.62,17.2 24.28,17.55 24.28,19.8 23.68,20.4 23.68,22.9 15.68,30.9 v15.2,30.85
DRD11  (via drill 0.4)
  Top 0.15: IC3.8 15.85,31.5 15.8,31.45 14.25,31.45 v14.1,31.3
  Bottom 0.15: CN1.16 24.62,21.98 24,22.6 24,23.08 15.68,31.45 14.25,31.45 v14.1,31.3
DRD12  (via drill 0.4)
  Top 0.15: IC3.6 15.3,32.5 v15.1,32.55
  Bottom 0.15: CN1.17 25.89,17.57 25.02,18.45 25.02,19.8 25.57,20.35 25.57,22.53 15.55,32.55 v15.1,32.55
DRD13  (via drill 0.4)
  Top 0.15: IC3.5 15.6,33 15.35,33.25 v14.3,33.25
  Bottom 0.15: CN1.18 25.89,22.66 15.3,33.25 v14.3,33.25
DRD14  (via drill 0.4)
  Top 0.15: IC3.3 15.3,34 v15.2,33.9
  Bottom 0.15: CN1.19 27.16,17.2 26.82,17.55 26.82,19.8 26.22,20.4 26.22,22.78 15.2,33.8 v15.2,33.9
DRD15  (via drill 0.4)
  Top 0.15: IC3.2 15.65,34.5 15.55,34.6 v14.4,34.6
  Bottom 0.15: v14.4,34.6 15.55,34.6 15.95,34.2 15.95,33.5 27.16,22.29 CN1.20
FB1
  Top 0.305: R1.2 81.78,62.05 IC7.4 80.33,63.19 80.01,63.5 74.93,63.5 73.66,62.23 73.66,41.91 75.06,40.64 R2.1
FD
  Bottom 0.305: CN7.3 95.5,44.29 R15.1
GND  (via drill 0.4, 0.6, 0.7)  (1 unrouted)
  Top 0.15: IC4.7 69.11,54.63 v69.22,54.74
  Top 0.305: IC4.13 66.11,54.88 C41.2 65.46,56.82 v65.53,56.9 | IC4.37 66.61,31.9 C42.2 67.26,30.05 v67.18,29.97 | IC5.3 35.87,51 v35.94,50.93 35.81,50.8 34.92,50.8 34.62,50.5 IC5.4 | IC5.142 36.69,52.97 v37.08,52.58 | IC5.42 38.19,33.87 v38.23,33.91 | IC5.53 v43.69,33.91 | IC5.63 48.69,33.83 v48.77,33.91 | IC5.68 51.19,33.41 v51.69,33.91 | IC5.83 57.78,39.5 v58.04,39.24 | IC5.137 39.19,52.63 v39.24,52.58 | IC5.133 41.19,52.62 v41.15,52.58 | IC5.125 45.19,52.6 v45.21,52.58 | v71.12,62.74 70.98,62.88 C1.2 69.33,62.61 65.02,62.61 64.39,63.25 IC6.5 | IC5.116 49.69,55.02 v50.29,55.63 | IC5.104 54.14,50 v53.85,50.29 | IC5.95 54.2,45.5 v53.85,45.85 | C3.1 83.58,58.66 83.82,58.42 | R1.1 83.78,60.62 v83.82,60.33 | IC3.45 26.06,33.5 C32.2 | IC3.28 26.04,25 C34.2
  Top 0.406: R26.1 78.19,38.23 v78.87,38.23 | v83.06,45.72 82.99,45.47 | R25.1 68.03,28.11 67.18,28.96 v67.18,29.97
  Top 0.61: IC9.2 v11.56,21.97 | C8.2 56.39,11.44 IC10.1 56.39,14.22 | CN1.77 63.99,15.1 63.12,14.22 56.39,14.22 | 56.39,14.22 55.12,14.22 | 55.12,14.22 53.85,14.22 | 53.85,14.22 52.58,14.22 IC10.4 | IC10.3 53.85,14.22 | IC10.2 55.12,14.22
  Top 1.27: v83.82,57.28 83.82,58.42 v83.82,60.33 | v78.87,38.23 80.46,38.23 C9.2 | v78.87,35.18 80.46,35.18 C2.2 | C5.2 82.99,45.47 82.99,45.53 | C6.2 75.76,45.65 v75.69,45.72 | C33.2 10.29,27.09 v10.29,29.59 10.29,31.94 C31.2
  Bottom 0.305: R10.1 30.1,43.56 29.72,43.18 29.72,40.64 30.86,39.5 v30.86,38.73 | C7.2 28.64,59.55 IC8.3 IC8.6 | R6.2 46.32,53.68 v45.21,52.58 | C21.2 20.05,44.82 v20.32,44.55 20.59,44.82 C22.2 | C23.2 20.1,41.54 v20.32,41.76 20.54,41.54 C24.2 | C11.2 20.15,58.79 v20.32,58.62 20.49,58.79 C12.2 | C13.2 20.15,55.51 v20.32,55.68 20.49,55.51 C14.2
  Bottom 0.406: C7.2 31.24,59.82 31.75,60.33 v31.75,61.72
  other vias: 15.19,11.61 14.4,61.04 58.17,51.94 58.42,54.61 31.11,37.72 32.13,50.93 31.11,50.93 20.74,23.78 22.67,34.68 77.22,57.66 87.25,6.86 17.8,26.67 20.27,11.61 77.22,60.07
  pour Bottom (no thermals): 50.67,36.96 38.23,36.96 38.23,49.4 50.67,49.4
  pour Bottom (no thermals): 56.26,51.05 58.67,51.05 58.67,56.01 56.26,56.01
  pour Bottom (no thermals): 56.26,34.32 56.26,39.6 58.42,39.6 58.42,34.32
  pour Bottom (no thermals): 33.27,35.59 32.38,35.56 30.61,37.46 30.61,39.12 31.5,40.01 33.27,40.01
  pour Bottom (no thermals): 32.64,50.74 30.73,50.74 30.73,56.05 32.64,56.05
  pour Ground (isolate 0.254, rank 3): 3.17,0 3.17,11.19 0,11.19 0.17,64.77 98.9,64.77 99.06,0
  pour Top (no thermals): 77.22,57.02 78.49,58.29 78.49,59.56 77.47,60.58 76.83,60.58 76.58,60.33 76.58,57.66
  pour Top (isolate 0.18, no thermals): 17.02,51.44 17.02,63.12 23.62,63.12 23.62,51.44
  pour Top (isolate 0.18, no thermals): 17.02,37.47 17.02,49.02 23.62,49.02 23.62,37.47
  pour Top (isolate 0.18, no thermals): 17.02,23.5 17.02,35.05 23.62,35.05 23.62,23.5
  pour Top (no thermals): 12.95,9.27 22.61,9.27 22.61,10.92 21.46,12.06 14.22,12.06 12.95,10.79
HAT_SCL
  Top 0.406: R17.2 52.34,5.78 arc45 52.52,5.71 CN2.28 53.77,6.94 arc45 53.85,7.12 IC10.6
HAT_SDA
  Top 0.2: 54.48,6.6 54.48,9.27
  Top 0.254: CN2.27 52.57,3.17 53.85,4.45 53.85,5.97 54.48,6.6 | 54.48,9.27 54.36,9.4 53.21,9.4 52.58,8.76 IC10.5
  Top 0.406: R18.1 51.97,8.02 arc45 52.15,7.94 IC10.5
HD  (via drill 0.4)
  Top 0.305: v92.33,27.05 92.33,35.05 98.04,40.77 98.04,45.59 96.77,46.86 96.77,48.69 CN7.4
  Bottom 0.305: R19.1 92.67,27.01 v92.33,27.05
INT2  (via drill 0.4)
  Top 0.15: IC1.11 15.82,58 15.62,58.2 14.46,58.2 v14.4,58.14
  Bottom 0.15: CN1.63 55.1,19.45 53.85,20.7 53.85,21.2 49.4,25.65 39.69,25.65 27.4,37.94 27.4,47.15 24.1,50.45 24.1,55.55 22.35,57.3 16.75,57.3 15.85,58.2 14.46,58.2 v14.4,58.14
IORD  (via drill 0.4)
  Top 0.15: IC1.8 15.66,59.5 15.62,59.54 v14.4,59.54
  Bottom 0.15: CN1.71 59.53,17.22 57.75,19 57.75,19.7 56.6,20.85 56.6,21.5 56.55,21.5 51.7,26.35 39.99,26.35 28,38.34 28,47.45 24.7,50.75 24.7,59.12 22.23,61.59 18.41,61.59 16.36,59.54 v14.4,59.54
IOWR  (via drill 0.4)
  Top 0.15: IC1.6 15.36,60.5 v15.2,60.34
  Bottom 0.15: CN1.72 58.98,21.03 57.78,22.23 56.33,22.23 51.85,26.7 40.14,26.7 28.3,38.54 28.3,47.6 25,50.9 25,59.25 22.35,61.9 16.76,61.9 v15.2,60.34
LB
  Top 0.15: IC5.79 67.02,37.5 69.11,35.41 IC4.42
LED
  Top 0.15: IC5.120 47.69,55.05 50.29,57.65 69.19,57.65 72.99,53.85 72.99,35.43 R23.1
MISO
  Top 0.15: CN2.21 44.92,3.34 44.43,3.83 arc-45 43.69,5.62 43.69,12.13 arc-27 43.96,13.28 44.31,13.96 arc59 44.2,16.46 arc-66 44.22,18.07 arc65 44.27,20.32 arc-50 44.24,21.53 44.7,22.35 44.83,22.61 arc32 45.2,23.98 45.19,24.22 IC5.56
MOSI
  Top 0.15: CN2.19 42.38,3.21 41.89,3.7 arc-45 41.15,5.5 41.15,12.63 arc-31 41.51,13.94 41.91,14.61 arc62 41.91,15.87 arc-61 41.76,18.44 44.23,22.4 arc30 44.69,24.04 IC5.55
N$1
  pour Power (isolate 0.254): 92.2,64.77 99.06,64.77 99.06,20.32 92.2,20.32
N$3
  Bottom 0.305: R7.2 LED1.A
N$5
  Top 0.15: R14.5 13.03,35.55 15.47,38 IC2.23
N$6
  Bottom 0.305: LED2.A 94.23,43.86 R15.2
N$7
  Top 0.406: D1.3 79.31,32.85 T3.B
N$9
  Top 0.406: D1.1 82.55,29.7 R28.1
N$31
  Top 0.15: R14.6 13.04,36.35 15.19,38.5 IC2.22
N$32
  Top 0.15: R14.7 13.06,37.15 15.4,39.5 IC2.20
N$33
  Top 0.15: R14.8 13.12,37.95 15.18,40.01 IC2.19
N$34
  Top 0.15: R13.5 13.2,39.87 14.33,41 IC2.17
N$35
  Top 0.15: R13.6 13.37,40.67 14.2,41.5 IC2.16
N$36
  Bottom 0.305: R19.2 LED34.AG
N$37
  Bottom 0.305: R22.2 LED34.AR
N$39
  Top 0.406: 71.67,29.93 T2.E 71.44,29.81 R25.2
N$41
  Top 0.406: T1.B 73.59,26.04 | 73.59,26.04 73.59,26.91 T2.C | R24.1 73.59,26.04
N$42
  Top 0.15: R13.7 13.53,41.47 14.56,42.5 IC2.14
N$43
  Top 0.15: R13.8 13.7,42.27 14.43,43 IC2.13
N$44
  Top 0.15: R12.5 13.75,44.19 14.44,43.5 IC2.12
N$45
  Top 0.15: R12.6 13.58,44.99 14.57,44 IC2.11
N$46
  Top 0.15: R12.7 13.42,45.79 14.21,45 IC2.9
N$47
  Top 0.15: R12.8 13.25,46.59 14.34,45.5 IC2.8
N$48
  Top 0.15: R11.5 13.09,48.51 15.1,46.5 IC2.6
N$49
  Top 0.15: R11.6 13.12,49.31 15.43,47 IC2.5
N$50
  Top 0.15: R11.7 13.21,50.06 15.31,47.95 IC2.3
N$51
  Top 0.15: R11.8 13.19,50.91 15.6,48.5 IC2.2
N$52
  Top 0.15: IC1.23 15,52 14.9,51.9 14.85,51.85 14,51.85 13.15,52.7 R5.2
N$53
  Top 0.406: T3.E 75.35,35.11 R26.2
N$54
  Top 0.406: T3.C 77.15,31.86 77.15,30.48 | 77.15,30.48 T4.B | R27.1 77.4,30.73 77.15,30.48
OE
  Top 0.15: IC5.84 65.54,40 70.11,35.43 IC4.44
PI_SCL
  Top 0.15: R21.2 7.62,4.7
  Top 0.2: CN2.5 23.07,4.7 7.62,4.7 5.84,4.7 3.81,6.73 3.81,40.42 CN6.3
PI_SDA
  Top 0.15: R20.2 9.4,4.06 9.27,4.19
  Top 0.2: CN2.3 21.04,4.19 9.27,4.19 5.59,4.19 2.5,7.28 CN6.4
  Bottom 0.254: 2.54,39.15 CN6.4
PW
  Bottom 0.305: R7.1 94.23,48.73 CN7.2
R24_LED
  Top 0.406: T2.B 73.66,30.12 R23.2 73.7,33.06 74.55,33.91 77.09,33.91 78.87,32.13 80.9,32.13 81.28,31.75 82.4,31.75 D1.2
RPI_IRQ  (via drill 0.4)
  Top 0.15: IC5.61 47.69,30.52 v48.16,30.05
  Bottom 0.15: v48.16,30.05 51.97,30.05 arc-45 54.14,29.11 60.96,21.79 arc-82 61.01,20.51 60.54,19.99 arc73 60.39,18.46 62.4,15.67 arc-100 62.05,14.16 49.56,7.27 arc-29 48.95,7.11 46.87,7.11 arc44 45.99,6.76 45.34,6.14 CN2.22
RTC_CS  (via drill 0.4)
  Top 0.15: IC1.9 15.36,59 v15.2,58.84
  Bottom 0.15: CN1.73 60.84,15.31 57.3,18.85 57.3,19.5 56.15,20.65 56.15,21.41 51.56,26 39.84,26 27.7,38.14 27.7,47.3 24.4,50.6 24.4,55.7 22.5,57.6 16.95,57.6 15.71,58.84 v15.2,58.84
RTC_SCL  (via drill 0.4)
  Top 0.15: IC5.97 53.45,46.5 52.45,47.5 52.45,51.05 54.86,53.47 58.17,53.47 v59.44,52.2 | IC6.8 v60.07,59.44 58.51,59.44 R4.1
  Bottom 0.15: v59.44,52.2 60.2,52.96 60.2,59.31 v60.07,59.44
RTC_SDA  (via drill 0.4)
  Top 0.15: IC5.112 51.69,51.81 51.94,51.56 52.32,51.56 54.61,53.85 58.67,53.85 v59.44,53.85 | IC6.7 v59.82,60.71 59.18,61.34 R3.1
  Bottom 0.15: v59.44,53.85 59.31,53.98 59.31,60.2 v59.82,60.71
SCE  (via drill 0.4)
  Top 0.15: IC5.80 54.39,38 54.19,37.8 v54.19,32.53
  Bottom 0.15: v54.19,32.53 54.19,30.75 arc45 54.87,28.88 61.22,22.08 arc-77 61.36,20.31 60.82,19.72 arc71 60.69,18.66 62.78,15.77 arc-97 62.37,13.91 CN2.24
SCLK
  Top 0.15: CN2.23 47.46,3.21 46.97,3.7 arc-45 46.23,5.5 46.23,12.55 arc35 45.78,13.98 45.66,14.15 arc-71 45.56,16.32 arc70 45.61,18.26 arc-67 45.48,19.96 arc56 45.85,21.69 45.79,21.89 arc-16 45.69,22.86 IC5.57
SRA0
  Top 0.15: IC5.93 62.28,44.5 70.11,52.33 IC4.5
SRA1
  Top 0.15: IC5.92 62.29,44 70.61,52.32 70.61,52.33 IC4.4
SRA2
  Top 0.15: IC5.91 62.3,43.5 71.11,52.31 IC4.3
SRA3
  Top 0.15: IC5.90 62.3,43 71.61,52.31 IC4.2
SRA4
  Top 0.15: IC5.89 62.31,42.5 72.11,52.3 IC4.1
SRA5
  Top 0.15: IC5.88 65.57,42 72.11,35.46 IC4.48
SRA6
  Top 0.15: IC5.87 65.56,41.5 71.61,35.45 IC4.47
SRA7
  Top 0.15: IC5.86 65.55,41 71.11,35.44 IC4.46
SRA8
  Top 0.15: IC5.85 65.55,40.5 70.61,35.44 IC4.45
SRA9
  Top 0.15: IC4.30 63.11,32 62.23,31.11 60.45,29.34 50.04,29.34 48.19,31.18 IC5.62
SRA10
  Top 0.15: IC4.29 62.61,32 61.98,31.37 60.33,29.72 50.8,29.72 50.16,29.72 49.19,30.69 IC5.64
SRA11
  Top 0.15: IC4.28 62.11,32.01 61.59,31.5 60.2,30.1 50.93,30.1 50.29,30.1 49.69,30.7 IC5.65
SRA12
  Top 0.15: IC4.27 61.61,32.02 61.21,31.62 60.07,30.48 51.05,30.48 50.42,30.48 50.19,30.71 IC5.66
SRA13
  Top 0.15: IC4.26 61.11,32.03 60.96,31.88 59.94,30.86 52.2,30.86 51.69,31.37 IC5.69
SRA14
  Top 0.15: IC4.25 60.61,32.03 60.33,31.75 59.82,31.24 52.32,31.24 52.19,31.38 IC5.70
SRA15
  Top 0.15: IC5.110 52.69,55.1 52.96,55.37 59.31,55.37 60.58,54.1 60.61,54.07 IC4.24
SRA16
  Top 0.15: IC5.111 52.19,55.11 52.83,55.75 59.44,55.75 61.09,54.1 61.11,54.08 IC4.23
SRA17
  Top 0.15: IC5.113 51.19,55 52.2,56.01 52.32,56.13 59.56,56.13 61.47,54.23 61.61,54.09 IC4.22
SRA18
  Top 0.15: IC5.114 50.69,55.01 52.2,56.52 59.69,56.52 61.98,54.23 62.11,54.09 IC4.21
SRA19
  Top 0.15: IC5.118 48.69,55.04 50.55,56.9 59.82,56.9 62.48,54.23 62.61,54.1 IC4.20
SRD0
  Top 0.15: IC4.8 68.61,51.34 63.27,46 IC5.96
SRD1
  Top 0.15: IC5.98 63.76,47 68.11,51.35 IC4.9
SRD2
  Top 0.15: IC5.99 63.76,47.5 67.61,51.35 IC4.10
SRD3
  Top 0.15: IC5.100 63.75,48 67.11,51.36 IC4.11
SRD4
  Top 0.15: IC5.101 63.74,48.5 65.61,50.37 IC4.14
SRD5
  Top 0.15: IC5.102 63.73,49 65.11,50.38 IC4.15
SRD6
  Top 0.15: IC5.105 62.69,50.5 64.52,52.32 64.61,52.42 IC4.16
SRD7
  Top 0.15: IC5.106 62.68,51 64.01,52.32 64.11,52.43 IC4.17
SRD8
  Top 0.15: IC4.32 64.11,32.49 62.61,30.99 60.58,28.96 48.13,28.96 47.19,29.9 47.19,31.68 IC5.60
SRD9
  Top 0.15: IC4.33 64.61,32.48 62.99,30.86 60.71,28.57 48.01,28.57 46.69,29.89 IC5.59
SRD10
  Top 0.15: IC4.34 65.11,32.47 63.37,30.73 60.83,28.19 47.88,28.19 46.19,29.88 IC5.58
SRD11
  Top 0.15: IC5.74 65.2,35 65.61,34.59 IC4.35
SRD12
  Top 0.15: IC5.75 66.99,35.5 67.11,35.38 IC4.38
SRD13
  Top 0.15: IC5.76 67,36 67.61,35.39 IC4.39
SRD14
  Top 0.15: IC5.77 67,36.5 68.11,35.4 IC4.40
SRD15
  Top 0.15: IC5.78 67.01,37 68.61,35.4 IC4.41
SW
  Top 0.305: L2.1 77.92,55.3 75.56,57.66 C4.2
  pour Top (no thermals): 77.22,54.61 77.22,56.13 79.12,58.04 79.12,59.31 79.63,59.31 79.63,58.04 81.53,56.13 81.53,54.61
TCK  (via drill 0.4)
  Top 0.15: IC5.18 35.37,43.5 v35.43,43.56
  Power 0.15: v35.43,43.56 34.67,43.56 34.04,42.93 34.04,24 36.32,21.72 36.32,20.7 37.59,19.43 37.59,18.41 38.23,17.78 38.23,16.76 37.59,16.13 37.59,4.15 CN2.11
  Bottom 0.305: R10.2 v35.43,43.56
TDI  (via drill 0.4)
  Top 0.15: v36.32,42.93 33.66,42.93 IC5.19
  Power 0.15: v36.32,42.93 36.32,41.91 34.8,41.15 34.8,25.27 38.61,21.46 38.61,20.95 40.01,19.56 40.01,18.41 40.77,17.65 40.77,16.64 40.13,16 40.13,14.22 43.56,10.79 43.56,5.8 CN2.16
  Bottom 0.305: R9.1 34.8,41.66 34.92,41.53 36.07,41.53 36.32,41.78 v36.32,42.93
TDO  (via drill 0.4)
  Top 0.15: IC5.20 35.22,42.5 v35.43,42.29
  Power 0.15: v35.43,42.29 34.92,42.29 34.42,41.78 34.42,25.15 38.23,21.34 38.23,20.7 39.5,19.43 39.5,18.29 38.99,17.78 38.99,16.64 39.62,16 39.62,13.97 39.88,13.72 39.88,4.4 CN2.13
TMS  (via drill 0.4)
  Top 0.15: IC5.16 36.02,44.5 v36.32,44.2
  Power 0.15: CN2.15 43.65,3.14 42.93,2.29 37.97,2.29 37.08,3.17 37.08,16.13 36.45,16.76 36.45,17.78 37.08,18.41 37.08,19.3 35.94,20.45 35.94,21.59 33.66,23.88 33.66,43.31 34.54,44.2 v36.32,44.2
  Bottom 0.305: R8.1 35.05,45.47 v36.32,44.2
UB
  Top 0.15: IC4.43 69.61,35.42 67.04,37.99 57.93,37.99 57.42,38.5 IC5.81
VCC/2
  Top 0.406: R18.2 49.26,9.6 arc45 49.19,9.42 R17.1 49.19,7.02 48.77,6.6 48.77,1.27
  Top 0.61: IC10.8 56.39,9.64 C8.1 60.16,7.9 R16.2 60.96,7.62 61.47,7.11 61.47,1.78 60.96,1.27 48.77,1.27 41.74,1.27 CN2.17 39.84,3.01 38.1,1.27 21.42,1.27 CN2.1 11.55,3.17 10.54,2.16 R20.1 9.03,2.15 8.26,2.92 8.04,2.92 R21.1
  Top 0.813: CN2.17 38.61,4.4 38.61,9.78 34.42,13.97 10.16,13.97 5.08,19.05 5.08,43.18 3.99,44.27 CN6.2
VOIDG
  cutout Ground (isolate 0.254, rank 2): 88.27,65 88.27,16.27 100,16.27 100,20.13 92,20.13 92,65
WE
  Top 0.15: IC5.119 48.19,55.05 50.42,57.28 59.94,57.28 62.99,54.23 63.37,54.23 63.63,53.98 63.63,53.27 IC4.18
WP
  Top 0.254: R16.1 58.17,7.62 58.17,7.37 57.66,6.86 57.4,6.86 56.9,6.35 55.88,6.35 55.12,7.11 IC10.7
(copper drawn outside any net)
  shapes: Bottom circle x1

## Text on the board
Top: 1
Ground: 2
Power: 3
Bottom: 4
tPlace: PD 2020 | 1 | 1 GND / 2 +3V3 / 3 SCL / 4 SDA | v1.0 | R | G | 2 | M. Rönndahl / N. Ekström | I C pullup / optional | CR2032 | (other side)
bPlace: A314 | LEDS
bNames: CR2032 | Raspberry Pi GPIO header | CN2
bKeepout: DRAM Area